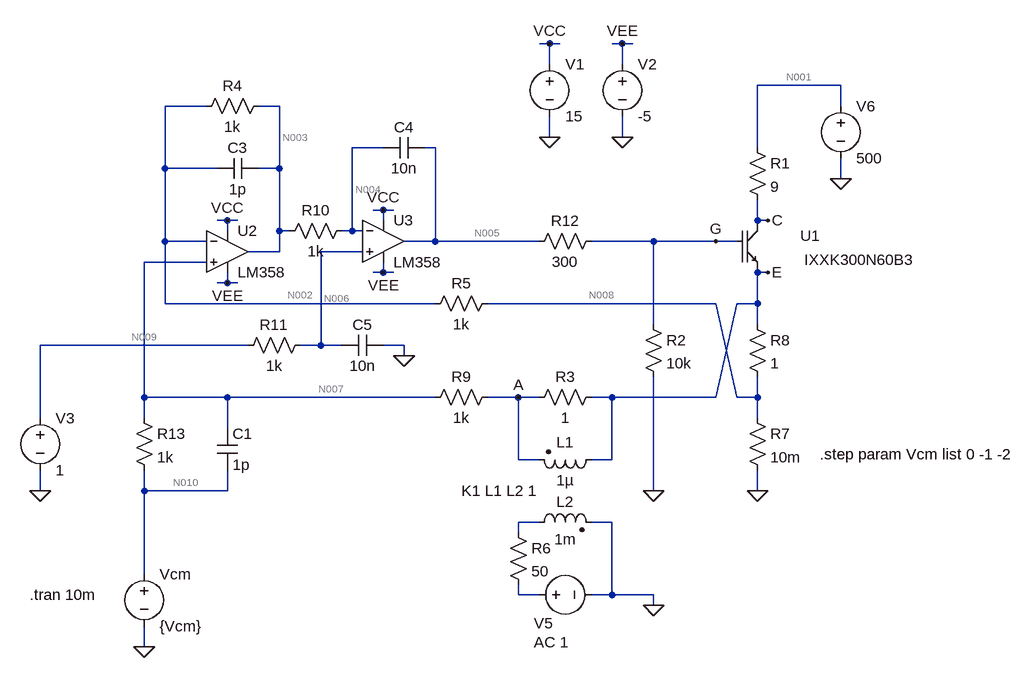
[diagram p0: schematic ConstantCurrentStepAmpRef.asc]
* ConstantCurrentStepAmpRef.asc
XU1 C G E IXXK300N60B3 IXXK300N60B3  ; pins C G E
R1 N001 C 9
R2 G 0 10k
* U2: LM358 (symbol LM358 not available, pins judged from their places): In+=N007 In-=N002 V+=VCC V-=VEE OUT=N003
V1 VCC 0 15
V2 VEE 0 -5
V3 N009 0 1
R5 N008 N002 1k
R8 E N008 1
C3 N003 N002 1p
R4 N003 N002 1k
* U3: LM358 (symbol LM358 not available, pins judged from their places): In+=N006 In-=N004 V+=VCC V-=VEE OUT=N005
V5 N012 0 AC 1
R9 A N007 1k
R13 N007 N010 1k
C1 N007 N010 1p
C4 N005 N004 10n
R10 N004 N003 1k
R11 N006 N009 1k
C5 0 N006 10n
L1 E A 1µ
L2 N011 0 1m
R3 E A 1
R6 N011 N012 50
V6 N001 0 500
R7 N008 0 10m
R12 G N005 300
Vcm N010 0 {Vcm}
K1 L1 L2 1
.tran 10m
.step param Vcm list 0 -1 -2
.lib ixxk300n60b3.lib
.backanno
.end

* Results of the author's LTspice run, read from the files saved beside the schematic
* Operating Point (first step), zero values left out:
*   vcm = -2 
*   V(c) = 473 V
*   V(e) = 3.03 V
*   V(g) = 9.48 V
*   V(n001) = 500 V
*   V(n007) = 514.9 mV
*   V(vee) = -5 V
*   V(n002) = 515 mV
*   V(vcc) = 15 V
*   V(n003) = 1 V
*   V(n009) = 1 V
*   V(n008) = 30 mV
*   V(n006) = 1 V
*   V(n004) = 1 V
*   V(n005) = 9.764 V
*   V(a) = 3.03 V
*   V(n010) = -2 V
*   I(L1) = 2.515 mA
*   I(R1) = 3.002 A
*   I(R2) = 948 µA
*   I(R5) = -485 µA
*   I(R8) = 3 A
*   I(R4) = 485 µA
*   I(R9) = 2.515 mA
*   I(R13) = 2.515 mA
*   I(R10) = 10.01 nA
*   I(R11) = 9.993 nA
*   I(R7) = 3 A
*   I(R12) = -948 µA
*   I(V1) = -685.3 µA
*   I(V2) = -747.7 µA
*   I(V3) = 9.993 nA
*   I(V6) = -3.002 A
*   I(Vcm) = 2.515 mA
*   Ix(u1:C) = 3.002 A
*   Ix(u1:E) = -3.002 A
*   Ix(u2:1) = -9.994 nA
*   Ix(u2:2) = -10.01 nA
*   Ix(u2:3) = -485 µA
*   Ix(u2:4) = 343.8 µA
*   Ix(u2:5) = 141.1 µA
*   Ix(u3:1) = -10.01 nA
*   Ix(u3:2) = -9.993 nA
*   Ix(u3:3) = -948 µA
*   Ix(u3:4) = 341.4 µA
*   Ix(u3:5) = 606.6 µA
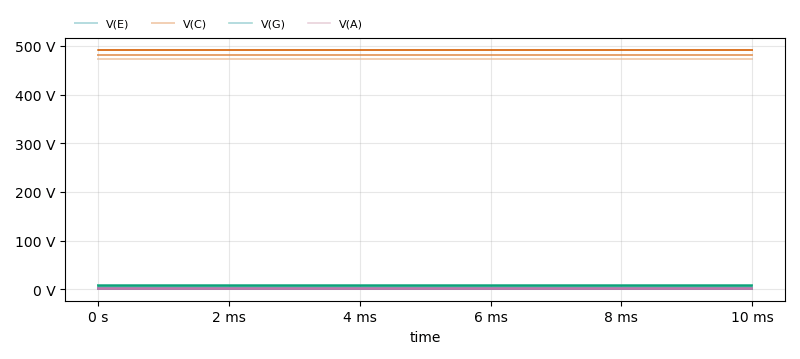
[diagram p1: Transient Analysis of ConstantCurrentStepAmpRef.asc, plotted from the saved traces]
* Transient Analysis, 3 runs:
*   V(E) [vcm=-2]: min 3.03 V, max 3.03 V, average 3.03 V, rms 3.03 V, last 3.03 V
*   V(E) [vcm=-1]: min 2.02 V, max 2.02 V, average 2.02 V, rms 2.02 V, last 2.02 V
*   V(E) [vcm=0]: min 1.01 V, max 1.01 V, average 1.01 V, rms 1.01 V, last 1.01 V
*   V(C) [vcm=-2]: min 473 V, max 473 V, average 473 V, rms 473 V, last 473 V
*   V(C) [vcm=-1]: min 482 V, max 482 V, average 482 V, rms 482 V, last 482 V
*   V(C) [vcm=0]: min 491 V, max 491 V, average 491 V, rms 491 V, last 491 V
*   V(G) [vcm=-2]: min 9.48 V, max 9.48 V, average 9.48 V, rms 9.48 V, last 9.48 V
*   V(G) [vcm=-1]: min 8.36 V, max 8.36 V, average 8.36 V, rms 8.36 V, last 8.36 V
*   V(G) [vcm=0]: min 7.204 V, max 7.204 V, average 7.204 V, rms 7.204 V, last 7.204 V
*   V(A) [vcm=-2]: min 3.03 V, max 3.03 V, average 3.03 V, rms 3.03 V, last 3.03 V
*   V(A) [vcm=-1]: min 2.02 V, max 2.02 V, average 2.02 V, rms 2.02 V, last 2.02 V
*   V(A) [vcm=0]: min 1.01 V, max 1.01 V, average 1.01 V, rms 1.01 V, last 1.01 V